# Altium schematic sheet MicroController Module Output Ports.SchDoc: MicroController Module Output Ports
size A3
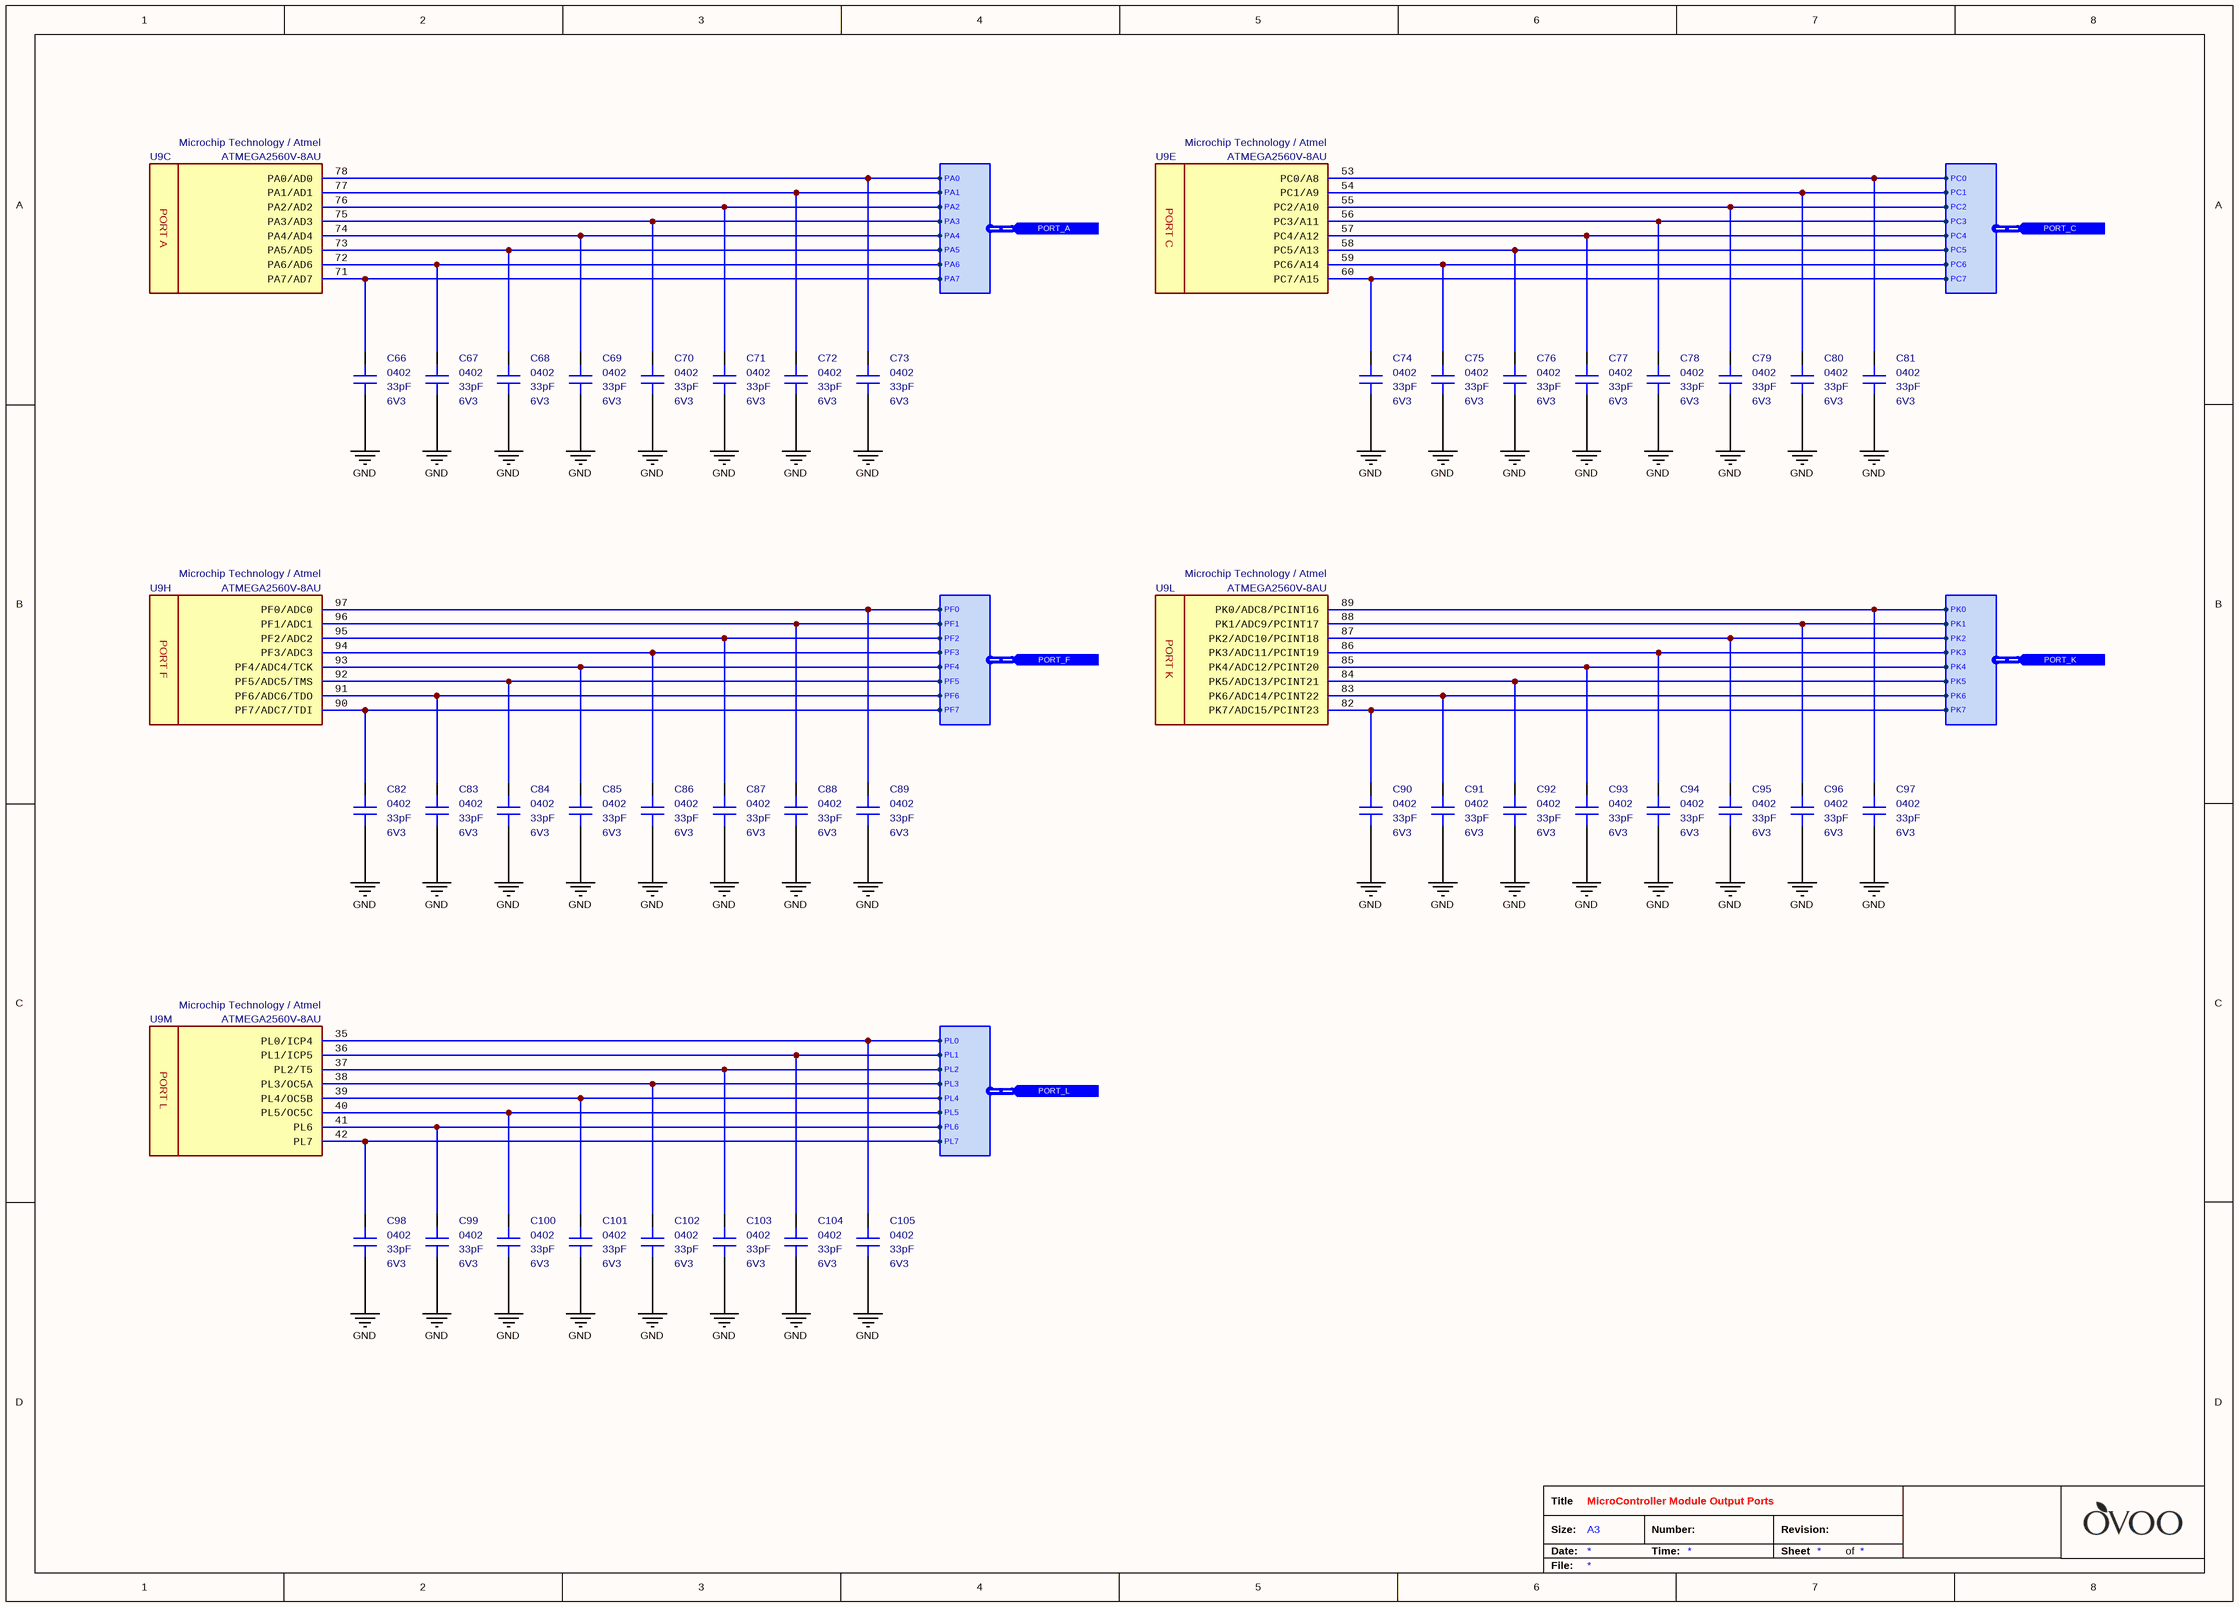
[diagram p0: MicroController Module Output Ports.SchDoc]

## Parts
C66  value 33pF  Case: 0402  Voltage: 6V3  [CAPACITOR_0402]  (hidden comment: Multilayer Ceramic Capacitor)
C67  value 33pF  Case: 0402  Voltage: 6V3  [CAPACITOR_0402]  (hidden comment: Multilayer Ceramic Capacitor)
C68  value 33pF  Case: 0402  Voltage: 6V3  [CAPACITOR_0402]  (hidden comment: Multilayer Ceramic Capacitor)
C69  value 33pF  Case: 0402  Voltage: 6V3  [CAPACITOR_0402]  (hidden comment: Multilayer Ceramic Capacitor)
C70  value 33pF  Case: 0402  Voltage: 6V3  [CAPACITOR_0402]  (hidden comment: Multilayer Ceramic Capacitor)
C71  value 33pF  Case: 0402  Voltage: 6V3  [CAPACITOR_0402]  (hidden comment: Multilayer Ceramic Capacitor)
C72  value 33pF  Case: 0402  Voltage: 6V3  [CAPACITOR_0402]  (hidden comment: Multilayer Ceramic Capacitor)
C73  value 33pF  Case: 0402  Voltage: 6V3  [CAPACITOR_0402]  (hidden comment: Multilayer Ceramic Capacitor)
C74  value 33pF  Case: 0402  Voltage: 6V3  [CAPACITOR_0402]  (hidden comment: Multilayer Ceramic Capacitor)
C75  value 33pF  Case: 0402  Voltage: 6V3  [CAPACITOR_0402]  (hidden comment: Multilayer Ceramic Capacitor)
C76  value 33pF  Case: 0402  Voltage: 6V3  [CAPACITOR_0402]  (hidden comment: Multilayer Ceramic Capacitor)
C77  value 33pF  Case: 0402  Voltage: 6V3  [CAPACITOR_0402]  (hidden comment: Multilayer Ceramic Capacitor)
C78  value 33pF  Case: 0402  Voltage: 6V3  [CAPACITOR_0402]  (hidden comment: Multilayer Ceramic Capacitor)
C79  value 33pF  Case: 0402  Voltage: 6V3  [CAPACITOR_0402]  (hidden comment: Multilayer Ceramic Capacitor)
C80  value 33pF  Case: 0402  Voltage: 6V3  [CAPACITOR_0402]  (hidden comment: Multilayer Ceramic Capacitor)
C81  value 33pF  Case: 0402  Voltage: 6V3  [CAPACITOR_0402]  (hidden comment: Multilayer Ceramic Capacitor)
C82  value 33pF  Case: 0402  Voltage: 6V3  [CAPACITOR_0402]  (hidden comment: Multilayer Ceramic Capacitor)
C83  value 33pF  Case: 0402  Voltage: 6V3  [CAPACITOR_0402]  (hidden comment: Multilayer Ceramic Capacitor)
C84  value 33pF  Case: 0402  Voltage: 6V3  [CAPACITOR_0402]  (hidden comment: Multilayer Ceramic Capacitor)
C85  value 33pF  Case: 0402  Voltage: 6V3  [CAPACITOR_0402]  (hidden comment: Multilayer Ceramic Capacitor)
C86  value 33pF  Case: 0402  Voltage: 6V3  [CAPACITOR_0402]  (hidden comment: Multilayer Ceramic Capacitor)
C87  value 33pF  Case: 0402  Voltage: 6V3  [CAPACITOR_0402]  (hidden comment: Multilayer Ceramic Capacitor)
C88  value 33pF  Case: 0402  Voltage: 6V3  [CAPACITOR_0402]  (hidden comment: Multilayer Ceramic Capacitor)
C89  value 33pF  Case: 0402  Voltage: 6V3  [CAPACITOR_0402]  (hidden comment: Multilayer Ceramic Capacitor)
C90  value 33pF  Case: 0402  Voltage: 6V3  [CAPACITOR_0402]  (hidden comment: Multilayer Ceramic Capacitor)
C91  value 33pF  Case: 0402  Voltage: 6V3  [CAPACITOR_0402]  (hidden comment: Multilayer Ceramic Capacitor)
C92  value 33pF  Case: 0402  Voltage: 6V3  [CAPACITOR_0402]  (hidden comment: Multilayer Ceramic Capacitor)
C93  value 33pF  Case: 0402  Voltage: 6V3  [CAPACITOR_0402]  (hidden comment: Multilayer Ceramic Capacitor)
C94  value 33pF  Case: 0402  Voltage: 6V3  [CAPACITOR_0402]  (hidden comment: Multilayer Ceramic Capacitor)
C95  value 33pF  Case: 0402  Voltage: 6V3  [CAPACITOR_0402]  (hidden comment: Multilayer Ceramic Capacitor)
C96  value 33pF  Case: 0402  Voltage: 6V3  [CAPACITOR_0402]  (hidden comment: Multilayer Ceramic Capacitor)
C97  value 33pF  Case: 0402  Voltage: 6V3  [CAPACITOR_0402]  (hidden comment: Multilayer Ceramic Capacitor)
C98  value 33pF  Case: 0402  Voltage: 6V3  [CAPACITOR_0402]  (hidden comment: Multilayer Ceramic Capacitor)
C99  value 33pF  Case: 0402  Voltage: 6V3  [CAPACITOR_0402]  (hidden comment: Multilayer Ceramic Capacitor)
C100  value 33pF  Case: 0402  Voltage: 6V3  [CAPACITOR_0402]  (hidden comment: Multilayer Ceramic Capacitor)
C101  value 33pF  Case: 0402  Voltage: 6V3  [CAPACITOR_0402]  (hidden comment: Multilayer Ceramic Capacitor)
C102  value 33pF  Case: 0402  Voltage: 6V3  [CAPACITOR_0402]  (hidden comment: Multilayer Ceramic Capacitor)
C103  value 33pF  Case: 0402  Voltage: 6V3  [CAPACITOR_0402]  (hidden comment: Multilayer Ceramic Capacitor)
C104  value 33pF  Case: 0402  Voltage: 6V3  [CAPACITOR_0402]  (hidden comment: Multilayer Ceramic Capacitor)
C105  value 33pF  Case: 0402  Voltage: 6V3  [CAPACITOR_0402]  (hidden comment: Multilayer Ceramic Capacitor)
U9  Manufacturer_Part_Number: ATMEGA2560V-8AU  Manufacturer_Name: Microchip Technology / Atmel  [TQFP100]  (hidden comment: 8-bit MicroController)  (parts C,E,H,L,M of 13)

## Ports
PORT_A (in, harness PORT_A), PORT_C (in, harness PORT_C), PORT_F (in, harness PORT_F), PORT_K (in, harness PORT_K), PORT_L (in, harness PORT_L)

## Harnesses
PORT_A: PA7, PA6, PA5, PA4, PA3, PA2, PA1, PA0
PORT_C: PC7, PC6, PC5, PC4, PC3, PC2, PC1, PC0
PORT_F: PF7, PF6, PF5, PF4, PF3, PF2, PF1, PF0
PORT_K: PK7, PK6, PK5, PK4, PK3, PK2, PK1, PK0
PORT_L: PL7, PL6, PL5, PL4, PL3, PL2, PL1, PL0

## Nets
GND: C66.1 C67.1 C68.1 C69.1 C70.1 C71.1 C72.1 C73.1 C74.1 C75.1 C76.1 C77.1 C78.1 C79.1 C80.1 C81.1 C82.1 C83.1 C84.1 C85.1 C86.1 C87.1 C88.1 C89.1 C90.1 C91.1 C92.1 C93.1 C94.1 C95.1 C96.1 C97.1 C98.1 C99.1 C100.1 C101.1 C102.1 C103.1 C104.1 C105.1
NetC66_2: C66.2 U9.71(PA7/AD7) ; port PORT_A.PA7
NetC67_2: C67.2 U9.72(PA6/AD6) ; port PORT_A.PA6
NetC68_2: C68.2 U9.73(PA5/AD5) ; port PORT_A.PA5
NetC69_2: C69.2 U9.74(PA4/AD4) ; port PORT_A.PA4
NetC70_2: C70.2 U9.75(PA3/AD3) ; port PORT_A.PA3
NetC71_2: C71.2 U9.76(PA2/AD2) ; port PORT_A.PA2
NetC72_2: C72.2 U9.77(PA1/AD1) ; port PORT_A.PA1
NetC73_2: C73.2 U9.78(PA0/AD0) ; port PORT_A.PA0
NetC74_2: C74.2 U9.60(PC7/A15) ; port PORT_C.PC7
NetC75_2: C75.2 U9.59(PC6/A14) ; port PORT_C.PC6
NetC76_2: C76.2 U9.58(PC5/A13) ; port PORT_C.PC5
NetC77_2: C77.2 U9.57(PC4/A12) ; port PORT_C.PC4
NetC78_2: C78.2 U9.56(PC3/A11) ; port PORT_C.PC3
NetC79_2: C79.2 U9.55(PC2/A10) ; port PORT_C.PC2
NetC80_2: C80.2 U9.54(PC1/A9) ; port PORT_C.PC1
NetC81_2: C81.2 U9.53(PC0/A8) ; port PORT_C.PC0
NetC82_2: C82.2 U9.90(PF7/ADC7/TDI) ; port PORT_F.PF7
NetC83_2: C83.2 U9.91(PF6/ADC6/TDO) ; port PORT_F.PF6
NetC84_2: C84.2 U9.92(PF5/ADC5/TMS) ; port PORT_F.PF5
NetC85_2: C85.2 U9.93(PF4/ADC4/TCK) ; port PORT_F.PF4
NetC86_2: C86.2 U9.94(PF3/ADC3) ; port PORT_F.PF3
NetC87_2: C87.2 U9.95(PF2/ADC2) ; port PORT_F.PF2
NetC88_2: C88.2 U9.96(PF1/ADC1) ; port PORT_F.PF1
NetC89_2: C89.2 U9.97(PF0/ADC0) ; port PORT_F.PF0
NetC90_2: C90.2 U9.82(PK7/ADC15/PCINT23) ; port PORT_K.PK7
NetC91_2: C91.2 U9.83(PK6/ADC14/PCINT22) ; port PORT_K.PK6
NetC92_2: C92.2 U9.84(PK5/ADC13/PCINT21) ; port PORT_K.PK5
NetC93_2: C93.2 U9.85(PK4/ADC12/PCINT20) ; port PORT_K.PK4
NetC94_2: C94.2 U9.86(PK3/ADC11/PCINT19) ; port PORT_K.PK3
NetC95_2: C95.2 U9.87(PK2/ADC10/PCINT18) ; port PORT_K.PK2
NetC96_2: C96.2 U9.88(PK1/ADC9/PCINT17) ; port PORT_K.PK1
NetC97_2: C97.2 U9.89(PK0/ADC8/PCINT16) ; port PORT_K.PK0
NetC98_2: C98.2 U9.42(PL7) ; port PORT_L.PL7
NetC99_2: C99.2 U9.41(PL6) ; port PORT_L.PL6
NetC100_2: C100.2 U9.40(PL5/OC5C) ; port PORT_L.PL5
NetC101_2: C101.2 U9.39(PL4/OC5B) ; port PORT_L.PL4
NetC102_2: C102.2 U9.38(PL3/OC5A) ; port PORT_L.PL3
NetC103_2: C103.2 U9.37(PL2/T5) ; port PORT_L.PL2
NetC104_2: C104.2 U9.36(PL1/ICP5) ; port PORT_L.PL1
NetC105_2: C105.2 U9.35(PL0/ICP4) ; port PORT_L.PL0

## Notes on the sheet
- Title
- Size:
- Date:
- A3
- Number:
- Time:
- Revision:
- Sheet
- of
- File:
- (in symbol IC - ATMEGA2560V-8AU, part C) PORT A
- (in symbol IC - ATMEGA2560V-8AU, part E) PORT C
- (in symbol IC - ATMEGA2560V-8AU, part H) PORT F
- (in symbol IC - ATMEGA2560V-8AU, part L) PORT K
- (in symbol IC - ATMEGA2560V-8AU, part M) PORT L

## Library data of the parts
C66-C105 = Capacitor - 33pF [0402-6V3]: Capacitor - 33pF [0402] (Ceramic); Manufacturer_Name: Kemet; Manufacturer_Part_Number: C0402C330J9RACAUTO; Dielectric: X7R; Tolerance: 10%; Height: 0.5mm; Mouser_Part_Number: 80-C0402C330J9RAUTO; Maximum Operating Temperature: +125; Minimum Operating Temperature: -55; ROHS: Yes; ComponentLink1Description: DataSheet; ComponentLink1URL: https://api.kemet.com/component-edge/download/datasheet/C0402C330J9RACAUTO.pdf; ComponentLink2Description: Mouser; ComponentLink2URL: https://www.mouser.com/Search/Refine.aspx?Keyword=80-C0402C330J9RAUTO; Supplier 1: Mouser; Supplier Part Number 1: 80-C0402C330J9RAUTO
U9 = IC - ATMEGA2560V-8AU: 8-bit Microcontrollers - MCU 256kB Flash 4kB EEPROM 86 I/O Pins; Supply Voltage - Min: 2V7; Supply Voltage - Max: 5.5V; Height: 1mm; Mouser_Part_Number: 556-ATMEGA2560V8AU; ComponentLink1Description: DataSheet; ComponentLink1URL: https://eu.mouser.com/datasheet/2/268/Atmel-2549-8-bit-AVR-Microcontroller-ATmega640-128-1315286.pdf; ROHS: Yes; Minimum Operating Temperature: -40; Maximum Operating Temperature: +85; ComponentLink2Description: Mouser; ComponentLink2URL: https://eu.mouser.com/ProductDetail/Microchip-Technology-Atmel/ATMEGA2560V-8AU?qs=sGAEpiMZZMutXGli8Ay4kKlCYcvZUWqJYdtgGFyqFT8%3D; Supplier 1: Mouser; Supplier 2: Arrow; Supplier 3: Farnell; Supplier 4: Newark; Supplier 5: Digi-Key; Supplier Part Number 1: 556-ATMEGA2560V8AU; Supplier Part Number 2: ATMEGA2560V-8AU; Supplier Part Number 3: 1288331; Supplier Part Number 4: 68T2784; Supplier Part Number 5: ATMEGA2560V-8AU-ND; Case: TQFP-100